# EAGLE design HighCurrentDriver (EAGLE 5.11)
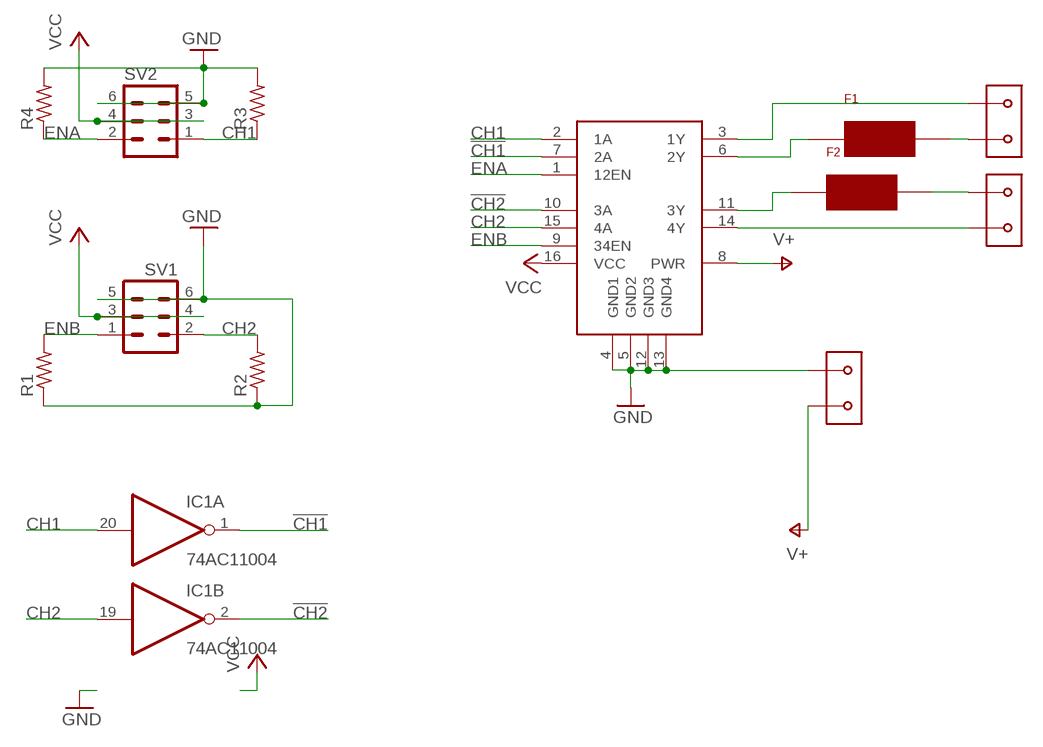
[diagram p0: schematic, sheet 1]

## Parts
F1  0154  [0154]
F2  0154  [0154]
IC1  74AC11004  [DIL20]
IC2  SN754410  [DIL16]
R1  R-US_0309/V  [0309V]
R2  R-US_0309/V  [0309V]
R3  R-US_0309/V  [0309V]
R4  R-US_0309/V  [0309V]
SV1  MA03-2  [MA03-2]
SV2  MA03-2  [MA03-2]
U$2  A98076-ND  [A98076-ND]
U$3  A98076-ND  [A98076-ND]
U$4  A98076-ND  [A98076-ND]

## Nets
!CH1: IC1.1(A:O) IC2.7(2A)
!CH2: IC1.2(B:O) IC2.15(4A)
CH1: IC1.20(A:I) IC2.2(1A) R3.1 SV2.1
CH2: IC1.19(B:I) IC2.10(3A) R2.2 SV1.2
ENA: IC2.1(12EN) R4.1 SV2.2
ENB: IC2.9(34EN) R1.2 SV1.1
GND: IC2.4(GND1) IC2.5(GND2) IC2.12(GND3) IC2.13(GND4) R1.1 R2.1 R3.2 R4.2 SV1.5 SV1.6 SV2.5 SV2.6 U$4.P$2
N$2: F1.2 U$3.P$1
N$3: IC2.14(4Y) U$2.P$1
N$4: F2.1 IC2.11(3Y)
N$5: F1.1 IC2.6(2Y)
N$6: IC2.3(1Y) U$3.P$2
N$7: F2.2 U$2.P$2
V+: IC2.8(PWR) U$4.P$1
VCC: IC2.16(VCC) SV1.3 SV1.4 SV2.3 SV2.4
Unconnected: IC1.3(C:O) IC1.8(D:O) IC1.9(E:O) IC1.10(F:O) IC1.11(F:I) IC1.12(E:I) IC1.13(D:I) IC1.18(C:I)

## Power pins joined to a net without a drawn wire
GND: IC1.4(P:GND) IC1.5(P:GND) IC1.6(P:GND) IC1.7(P:GND)
VCC: IC1.15(P:VCC) IC1.16(P:VCC)

## Library data of the parts
F1 F2 = SMT_Fuse_0154001:0154
IC1 = 74ac-logic:74AC11004: Hex INVERTER
IC2 = SN754410:SN754410
R1-R4 = resistor:R-US_: RESISTOR, American symbol
SV1 SV2 = con-lstb:MA03-2: PIN HEADER
U$2-U$4 = A98076-ND:A98076-ND

## Board
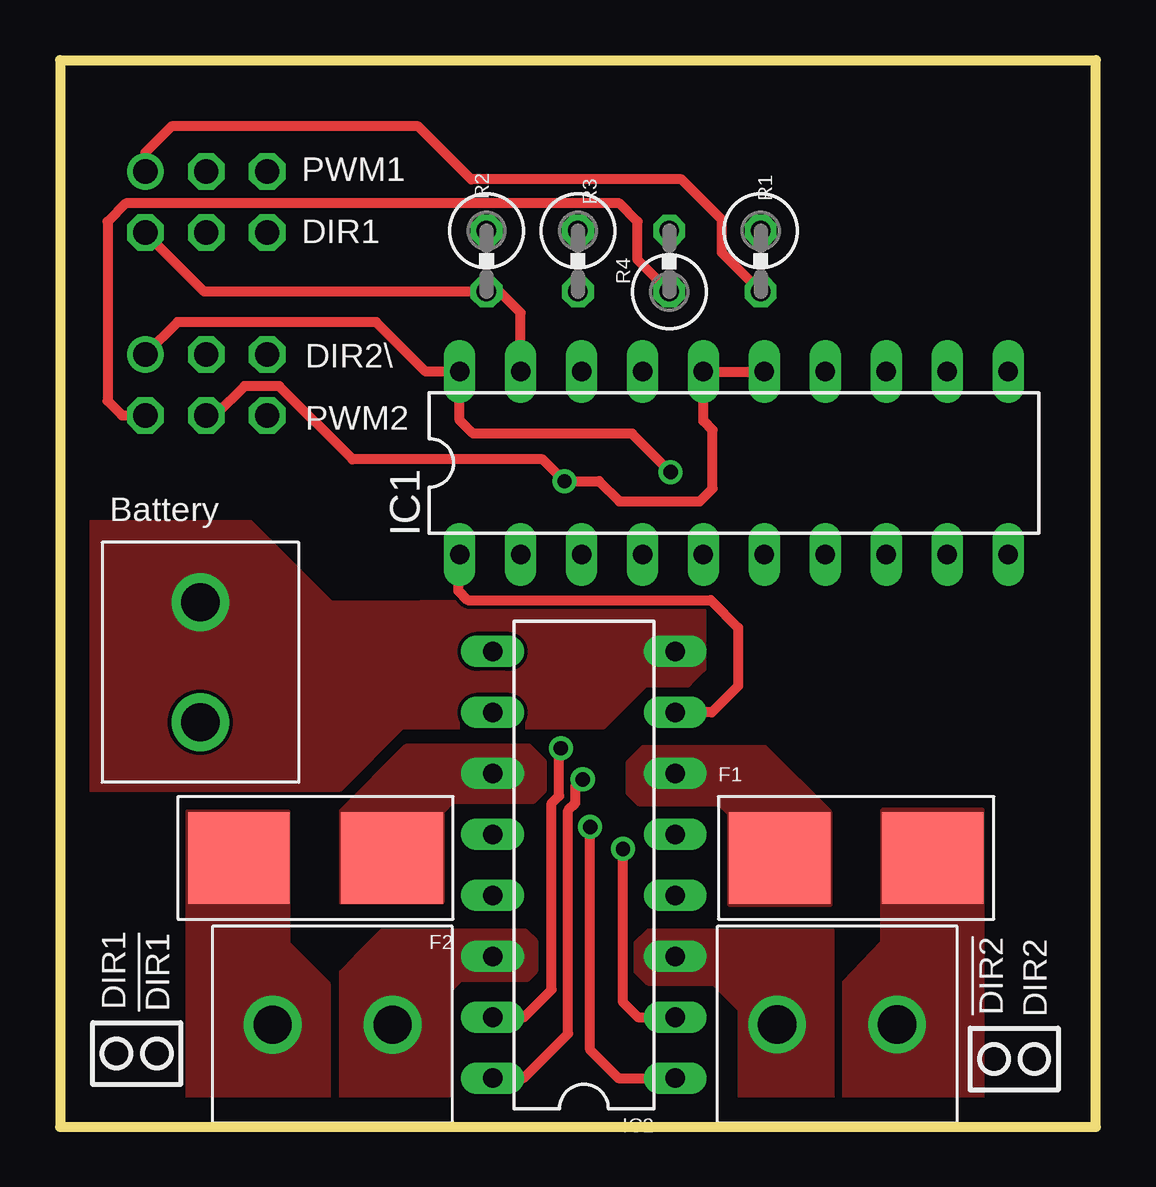
[diagram p1: board, top side]
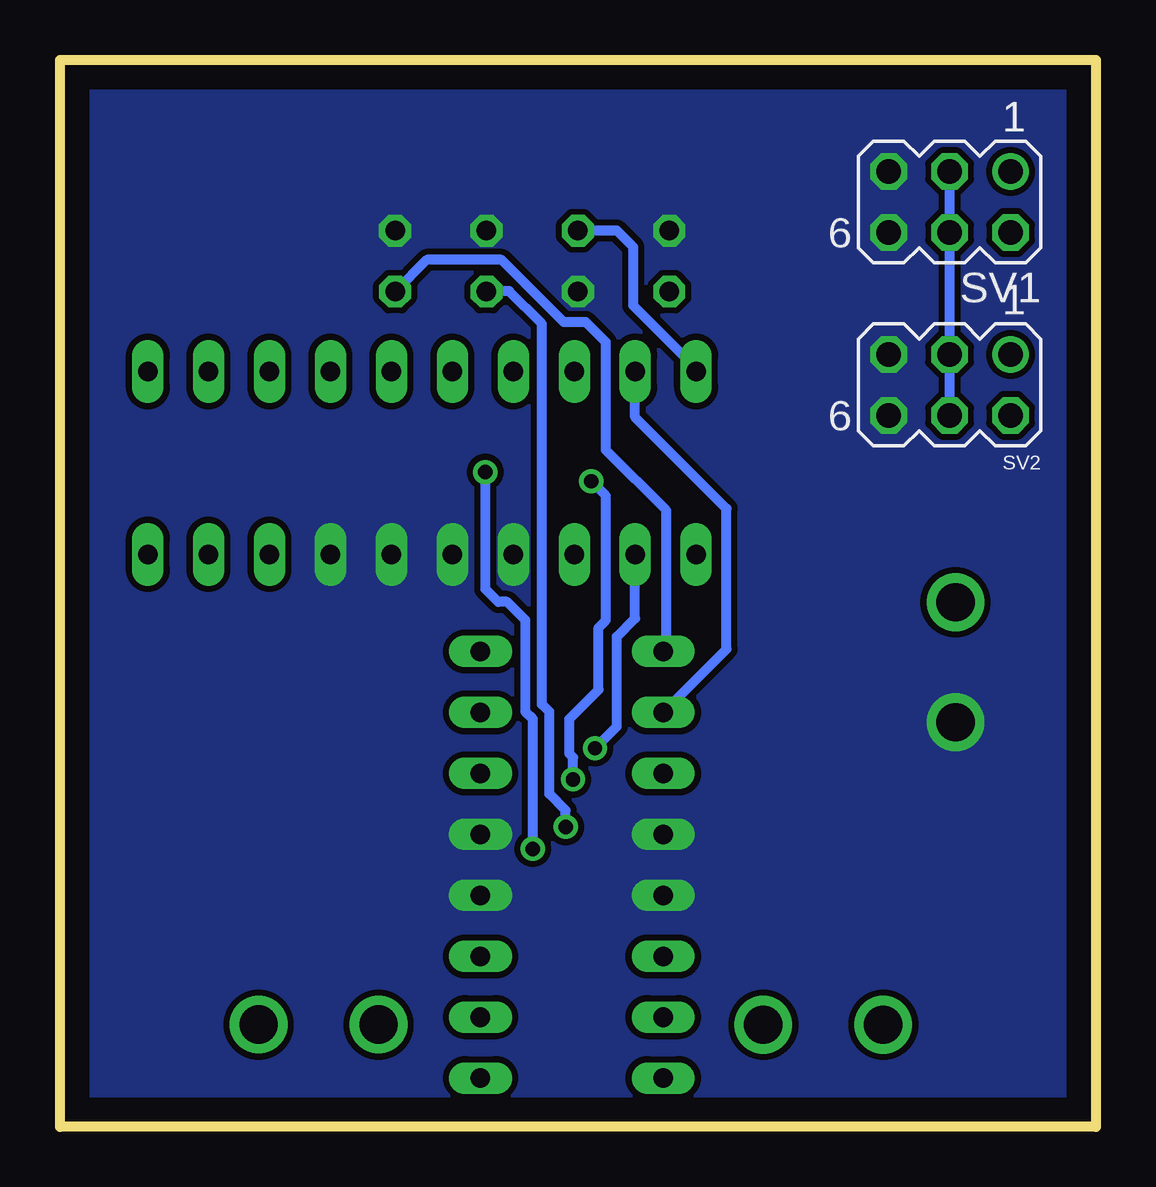
[diagram p2: board, bottom side, seen from below]

Size 43.18 x 44.45 mm. Coordinates in mm from the lower left corner, seen from the top.
Outline: 0,0 43.18,0 43.18,44.45 0,44.45 0,0
Copper layers (1*16): Top 0.035mm / dielectric 1.5mm / Bottom 0.035mm
Design rules "default *": minimum track width 6mil, minimum drill 15mil, track to track 6mil, track to pad 6mil, pad to pad 6mil, via to via 6mil, smd to smd 6mil, copper to edge 40mil, drill to drill 6mil, minimum pad ring 10mil, minimum via ring 8mil, stop-mask expansion 4mil, vias tented up to drill 30mil, thermal gap 10mil

### Footprints (pad centres in the part's own frame; a part is rotated, then mirrored left to right if it is on the bottom)
0154 = smd 4.24 x 3.81: 1 0,0; 2 6.38,0
DIL20 = drill 0.813 long: 1 -11.43,-3.81; 2 -8.89,-3.81; 3 -6.35,-3.81; 4 -3.81,-3.81; 5 -1.27,-3.81; 6 1.27,-3.81; 7 3.81,-3.81; 8 6.35,-3.81; 9 8.89,-3.81; 10 11.43,-3.81; 11 11.43,3.81; 12 8.89,3.81; 13 6.35,3.81; 14 3.81,3.81; 15 1.27,3.81; 16 -1.27,3.81; 17 -3.81,3.81; 18 -6.35,3.81; 19 -8.89,3.81; 20 -11.43,3.81
DIL16 = drill 0.813 long: 1 -8.89,-3.81; 2 -6.35,-3.81; 3 -3.81,-3.81; 4 -1.27,-3.81; 5 1.27,-3.81; 6 3.81,-3.81; 7 6.35,-3.81; 8 8.89,-3.81; 9 8.89,3.81; 10 6.35,3.81; 11 3.81,3.81; 12 1.27,3.81; 13 -1.27,3.81; 14 -3.81,3.81; 15 -6.35,3.81; 16 -8.89,3.81
0309V = drill 0.813 octagon: 1 -1.27,0; 2 1.27,0
MA03-2 = drill 1.016 round: 1 -2.54,-1.27 | drill 1.016 octagon: 2 -2.54,1.27; 3 0,-1.27; 4 0,1.27; 5 2.54,-1.27; 6 2.54,1.27
A98076-ND = drill 1.6 round: P$1 0,0; P$2 5,0

### Placement (x,y rotation side)
F1  30,11.2 0 top
F2  13.84,11.2 180 top
IC1  28.09,27.66 0 top
IC2  21.84,10.91 90 top
R1  29.21,36.07 270 top
R2  17.78,36.07 270 top
R3  21.59,36.07 270 top
R4  25.4,36.07 90 top
SV1  6.1,38.53 180 bottom
SV2  6.1,30.91 180 bottom
U$2  13.86,4.25 180 top
U$3  34.9,4.26 180 top
U$4  5.85,21.86 270 top

### Tracks (layer width: path | path; a pad name or v marks a point on that pad's centre or on a via)
!CH1
  Top 0.406: IC2.7 27.17,17.27 28.27,18.36 28.27,20.8 27.13,21.95 16.99,21.95 16.61,22.33 16.61,23.8 IC1.1
!CH2  (via drill 0.6)
  Top 0.406: IC2.15 19.35,4.57 20.5,5.71 20.5,13.49 20.8,13.79 20.8,15.7 v20.88,15.77
  Bottom 0.406: v20.88,15.77 19.96,16.69 19.96,20.42 19.2,21.18 IC1.2
CH1  (via drill 0.6)
  Top 0.406: IC2.2 24.09,4.57 23.47,5.18 v23.47,11.58 | v25.45,27.28 23.85,28.88 17.22,28.88 16.66,29.44 IC1.20 15.24,31.47 13.18,33.53 4.9,33.53 SV2.1
  Bottom 0.406: v23.47,11.58 23.47,16.99 23.77,17.3 23.77,21.11 24.54,21.87 24.92,21.87 25.45,22.4 v25.45,27.28 | IC1.20 16.66,31.6 19.28,34.21 19.28,36.65 19.96,37.34 R3.1
CH2
  Top 0.406: IC1.19 19.2,33.91 18.31,34.8 R2.2 6.02,34.8 SV1.2
  Bottom 0.406: IC2.10 15.39,19.9 15.39,25.76 19.2,29.57 IC1.19
ENA  (via drill 0.6)
  Top 0.406: IC2.1 23.27,2.02 22.1,3.2 v22.1,12.5 | R4.1 24.08,36.12 24.08,37.72 23.32,38.48 2.74,38.48 1.98,37.72 1.98,30.25 2.59,29.64 SV2.2
  Bottom 0.406: v22.1,12.5 22.1,13.18 22.78,13.87 22.78,17.3 23.09,17.6 23.09,33.45 24.46,34.82 25.38,34.82 R4.1
ENB
  Top 0.406: R1.2 27.58,36.42 27.58,37.8 25.91,39.47 17.14,39.47 14.94,41.68 4.65,41.68 3.56,40.59 SV1.1
  Bottom 0.406: IC2.9 17.91,19.93 17.91,25.68 20.42,28.19 20.42,32.69 21.26,33.53 22.17,33.53 24.77,36.12 27.89,36.12 R1.2
GND
  pour Bottom (isolate 0.254, no thermals): 43.13,44.5 43.21,0 0.08,0 0,44.5
N$2
  pour Top (isolate 0.254, no thermals): 38.46,13.18 34.29,13.18 34.29,7.7 32.69,6.02 32.69,0.08 38.46,0.08
N$3
  pour Top (isolate 0.254, no thermals): 11.71,0.03 16.28,0.03 16.28,5.74 16.69,6.15 19.48,6.15 19.84,6.5 19.84,6.71 19.84,7.72 19.41,8.15 13.44,8.15 12.32,7.04 11.71,6.43
N$4
  pour Top (isolate 0.254, no thermals): 11.73,13.16 14.45,15.88 19.53,15.88 20.17,15.24 20.17,14 19.71,13.54 19.33,13.54 16.33,13.54 15.93,13.13 15.93,9.35 11.73,9.35
N$5
  pour Top (isolate 0.254, no thermals): 32.11,13.08 29.39,15.8 24.31,15.8 23.67,15.16 23.67,13.92 24.13,13.46 27.51,13.46 27.91,13.06 27.91,9.27 32.11,9.27
N$6
  pour Top (isolate 0.254, no thermals): 28.37,0.03 28.37,4.88 27.28,5.97 24.54,5.97 23.98,6.53 23.98,7.62 24.54,8.18 32.18,8.18 32.18,-0.05 28.37,-0.05 28.37,0
N$7
  pour Top (isolate 0.254, no thermals): 5.33,13.13 9.5,13.13 9.5,9.37 9.5,7.65 11.18,5.97 11.18,0.03 6.02,0.03 5.33,0.03
V+
  pour Top (no thermals): 26.75,21.79 26.21,21.79 11.28,21.72 7.92,25.07 -0.61,25.07 -0.61,14.17 11.66,14.17 14.25,16.76 22.63,16.76 24.38,18.52 26.14,18.52 26.75,19.13
VCC  (via drill 0.6)
  Top 0.406: IC2.16 19.32,2.02 21.18,3.89 21.18,13.18 21.49,13.49 21.49,14.17 v21.79,14.48 | IC1.15 IC1.16 26.82,29.41 27.2,29.03 27.2,26.59 26.67,26.06 23.32,26.06 22.48,26.9 v21.03,26.9 20.12,27.81 12.19,27.81 9.14,30.86 7.7,30.86 6.48,29.64 SV2.4
  Bottom 0.406: v21.79,14.48 21.79,15.39 21.95,15.54 21.95,16.99 20.73,18.21 20.73,20.8 20.42,21.11 20.42,26.29 v21.03,26.9 | SV2.4 SV2.3 SV1.4 SV1.3

### Text on the board
tPlace: PWM1 | DIR1 | DIR2\ | PWM2 | Battery | DIR1 | !DIR1 | !DIR2 | DIR2